# EAGLE design 6502_BASIC (EAGLE 7.1.0)
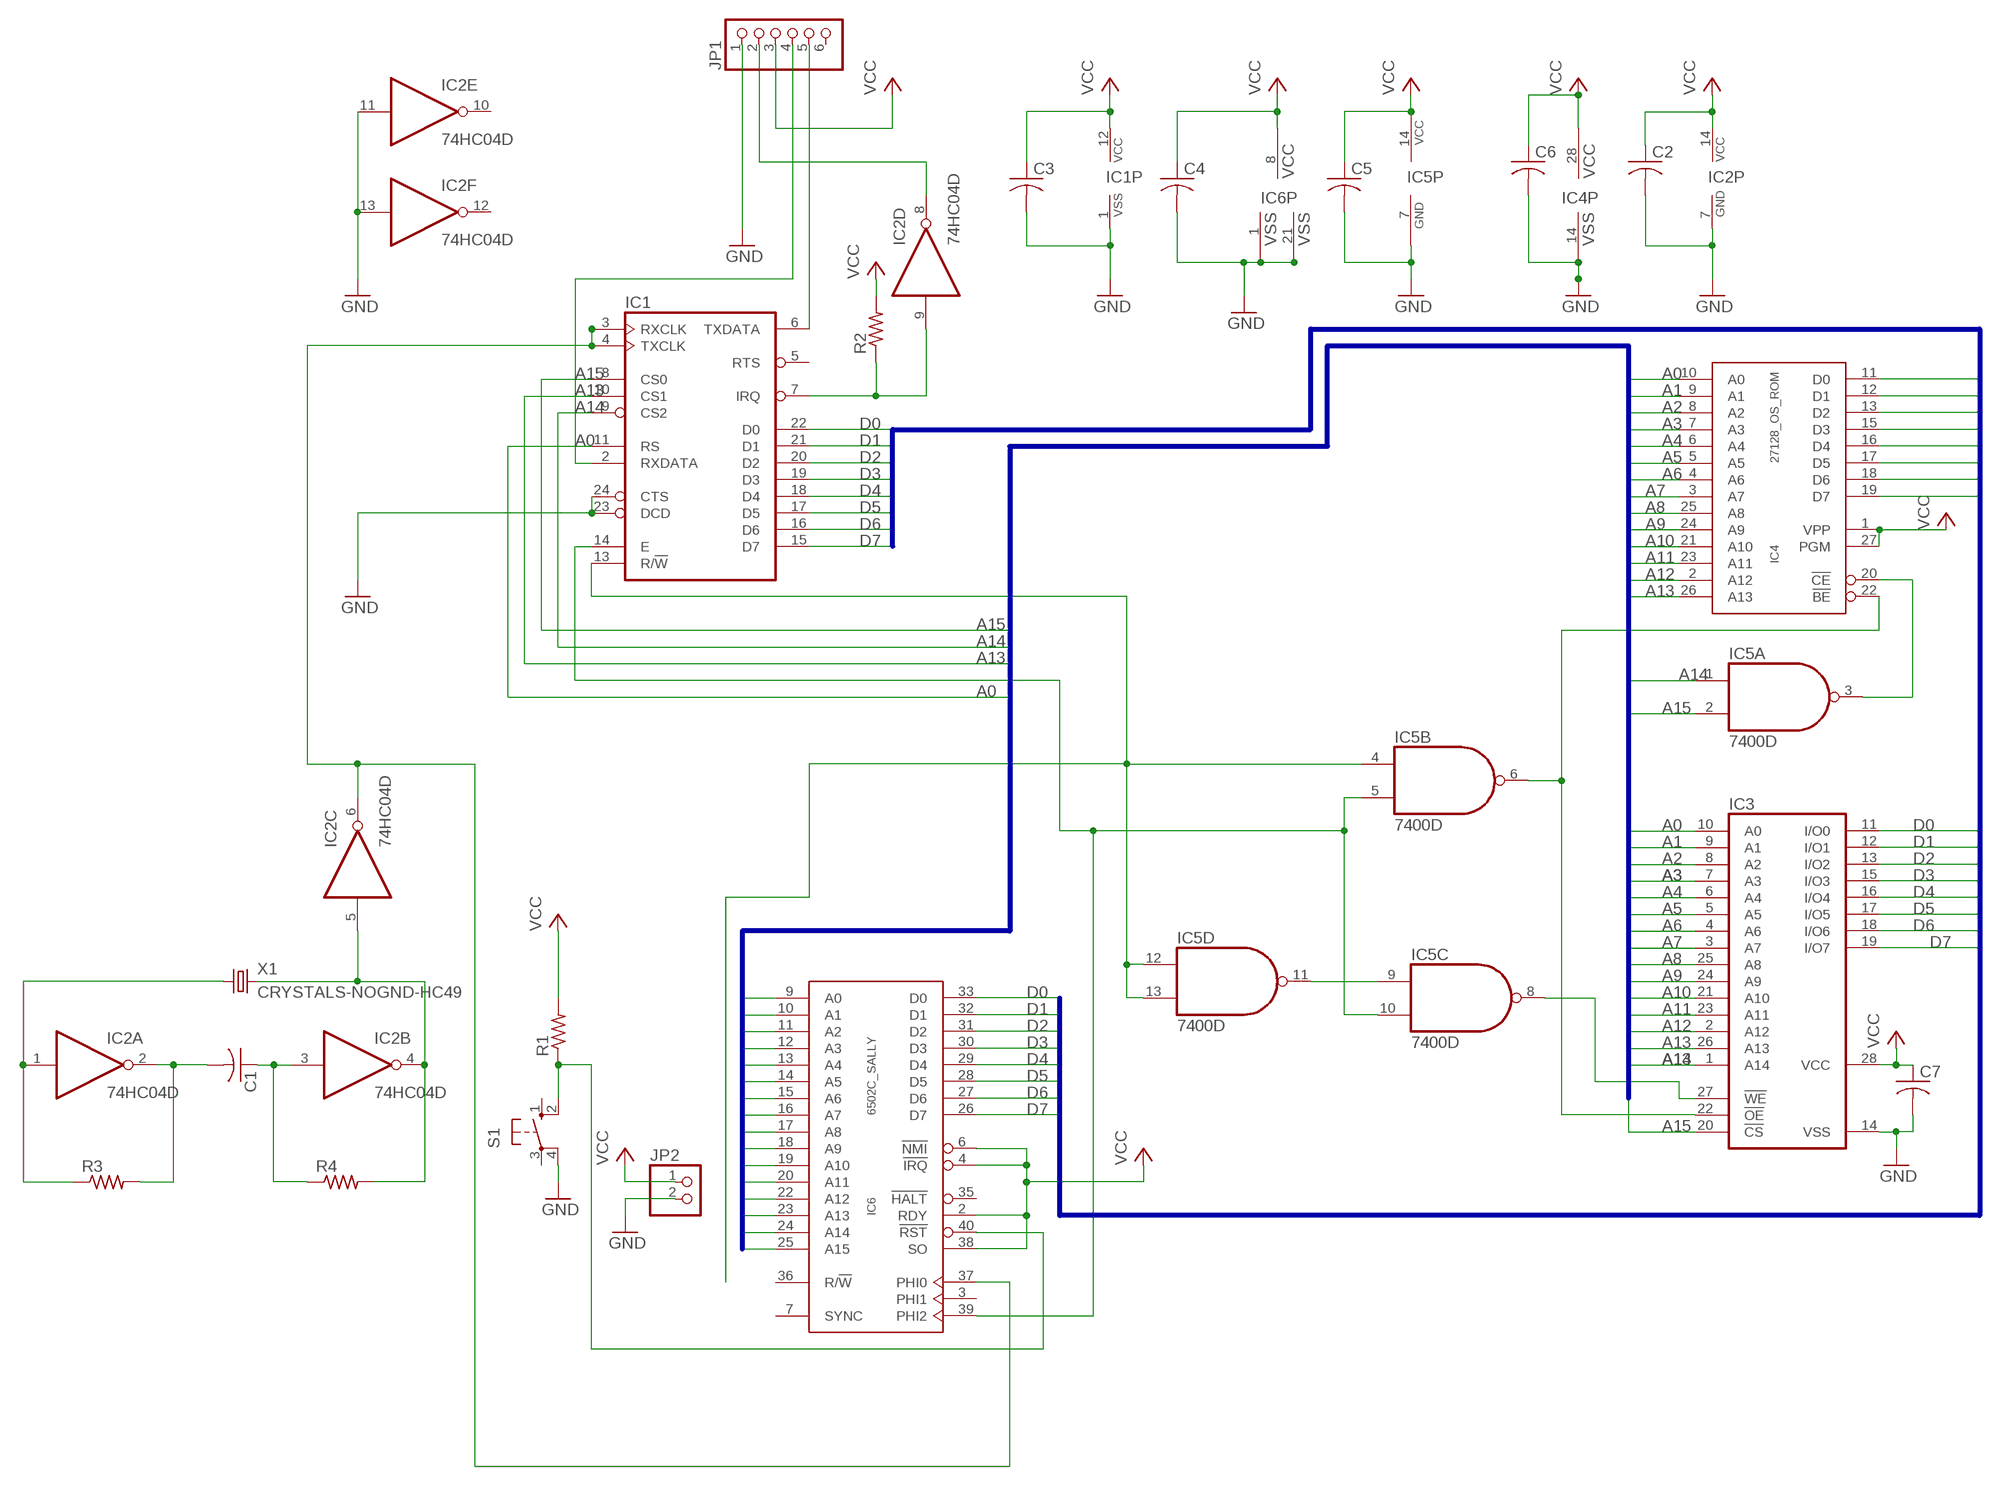
[diagram p0: schematic, sheet 1]

## Parts
C1  C-USC1608  [C1608]
C2  C-USC1608  [C1608]
C3  C-USC1608  [C1608]
C4  C-USC1608  [C1608]
C5  C-USC1608  [C1608]
C6  C-USC1608  [C1608]
C7  C-USC1608  [C1608]
IC1  6850  [DIL24]
IC2  74HC04D  [SO14]
IC3  62256P  [DIL28-6]
IC4  27128_OS_ROM  [DIL28]
IC5  7400D  [SO14]
IC6  6502C_SALLY  [DIL40]
JP1  HEADER-1X6  [1X06_OVAL]
JP2  HEADER-1X2  [1X02_OVAL]
R1  R-US_R0603  [R0603]
R2  R-US_R0603  [R0603]
R3  R-US_R0603  [R0603]
R4  R-US_R0603  [R0603]
S1  10-XX  [B3F-10XX]
X1  CRYSTALS-NOGND-HC49  [HC49]

## Nets
A0: IC1.11(RS) IC3.10(A0) IC4.10(A0) IC6.9(A0)
A1: IC3.9(A1) IC4.9(A1) IC6.10(A1)
A2: IC3.8(A2) IC4.8(A2) IC6.11(A2)
A3: IC3.7(A3) IC4.7(A3) IC6.12(A3)
A4: IC3.6(A4) IC4.6(A4) IC6.13(A4)
A5: IC3.5(A5) IC4.5(A5) IC6.14(A5)
A6: IC3.4(A6) IC4.4(A6) IC6.15(A6)
A7: IC3.3(A7) IC4.3(A7) IC6.16(A7)
A8: IC3.25(A8) IC4.25(A8) IC6.17(A8)
A9: IC3.24(A9) IC4.24(A9) IC6.18(A9)
A10: IC3.21(A10) IC4.21(A10) IC6.19(A10)
A11: IC3.23(A11) IC4.23(A11) IC6.20(A11)
A12: IC3.2(A12) IC4.2(A12) IC6.22(A12)
A13: IC1.10(CS1) IC3.26(A13) IC4.26(A13) IC6.23(A13)
A14: IC1.9(CS2) IC3.1(A14) IC5.1(A:I0) IC6.24(A14)
A15: IC1.8(CS0) IC3.20(!CS) IC5.2(A:I1) IC6.25(A15)
D0: IC1.22(D0) IC3.11(I/O0) IC4.11(D0) IC6.33(D0)
D1: IC1.21(D1) IC3.12(I/O1) IC4.12(D1) IC6.32(D1)
D2: IC1.20(D2) IC3.13(I/O2) IC4.13(D2) IC6.31(D2)
D3: IC1.19(D3) IC3.15(I/O3) IC4.15(D3) IC6.30(D3)
D4: IC1.18(D4) IC3.16(I/O4) IC4.16(D4) IC6.29(D4)
D5: IC1.17(D5) IC3.17(I/O5) IC4.17(D5) IC6.28(D5)
D6: IC1.16(D6) IC3.18(I/O6) IC4.18(D6) IC6.27(D6)
D7: IC1.15(D7) IC3.19(I/O7) IC4.19(D7) IC6.26(D7)
GND: C2.2 C3.2 C4.2 C5.2 C6.2 C7.2 IC1.1(VSS) IC1.23(DCD) IC1.24(CTS) IC2.7(P:GND) IC2.11(E:I) IC2.13(F:I) IC3.14(VSS) IC4.14(VSS) IC5.7(P:GND) IC6.1(VSS) IC6.21(VSS1) JP1.1 JP2.2 S1.4(P1)
N$1: IC3.27(!WE) IC5.8(C:O)
N$2: IC3.22(!OE) IC4.22(!BE) IC5.6(B:O)
N$3: IC1.3(RXCLK) IC1.4(TXCLK) IC2.6(C:O) IC6.37(PHI0)
N$4: IC5.9(C:I0) IC5.11(D:O)
N$5: IC4.20(!CE) IC5.3(A:O)
N$6: IC1.14(E) IC5.5(B:I1) IC5.10(C:I1) IC6.39(PHI2)
N$7: IC1.13(R/!W) IC5.4(B:I0) IC5.12(D:I0) IC5.13(D:I1)
N$8: IC2.4(B:O) IC2.5(C:I) R4.2 X1.2
N$9: IC1.7(IRQ) IC2.9(D:I) R2.1
N$10: IC2.8(D:O) JP1.2
N$11: C1.1 IC2.3(B:I) R4.1
N$12: IC6.40(!RST) R1.1 S1.2(S1)
N$13: C1.2 IC2.2(A:O) R3.2
N$14: IC2.1(A:I) R3.1 X1.1
N$18: IC1.6(TXDATA) JP1.5
N$19: IC1.2(RXDATA) JP1.4
VCC: C2.1 C3.1 C4.1 C5.1 C6.1 C7.1 IC1.12(VCC) IC2.14(P:VCC) IC3.28(VCC) IC4.1(VPP) IC4.27(PGM) IC4.28(VCC) IC5.14(P:VCC) IC6.2(RDY) IC6.4(!IRQ) IC6.6(!NMI) IC6.8(VCC) IC6.38(SO) JP1.3 JP2.1 R1.2 R2.2
Unconnected: IC1.5(RTS) IC2.10(E:O) IC2.12(F:O) IC6.3(PHI1) IC6.7(SYNC) IC6.35(!HALT) IC6.36(R/!W) JP1.6 S1.1(S) S1.3(P)

## Buses
D[0..7]
A[0..15]

## Library data of the parts
C1-C7 = resistor:C-US: CAPACITOR, American symbol
IC1 = micro-motorola:6850: MICROCONTROLLER/MEMORY DEVICE; MF: NTE ELECTRONICS; MPN: NTE6850; OC_FARNELL: 4899775; OC_NEWARK: 31C2457
IC2 = 74xx-eu:74*04: Hex INVERTER
IC3 = memory-hitachi:62256P: MEMORY; OC_FARNELL: unknown; OC_NEWARK: unknown
IC4 = eagle-6.5.0-atari:27128_OS_ROM: 16K x 8 PROM
IC5 = 74xx-us:74*00: Quad 2-input NAND gate
IC6 = eagle-6.5.0-atari:6502C_SALLY: Atari 6502 Custom CPU
JP1 = OLED_mod:HEADER-1X6: PIN HEADER
JP2 = OLED_mod:HEADER-1X2: PIN HEADER
R1-R4 = rcl:R-US_: RESISTOR, American symbol
S1 = switch-omron:10-XX: OMRON SWITCH; MPN: B3F-1000; OC_FARNELL: 176432; OC_NEWARK: 36M3542
X1 = IQD-Frequency-Products:CRYSTALS-NOGND: CRYSTALS CAN NOT GROUNDED

## Board
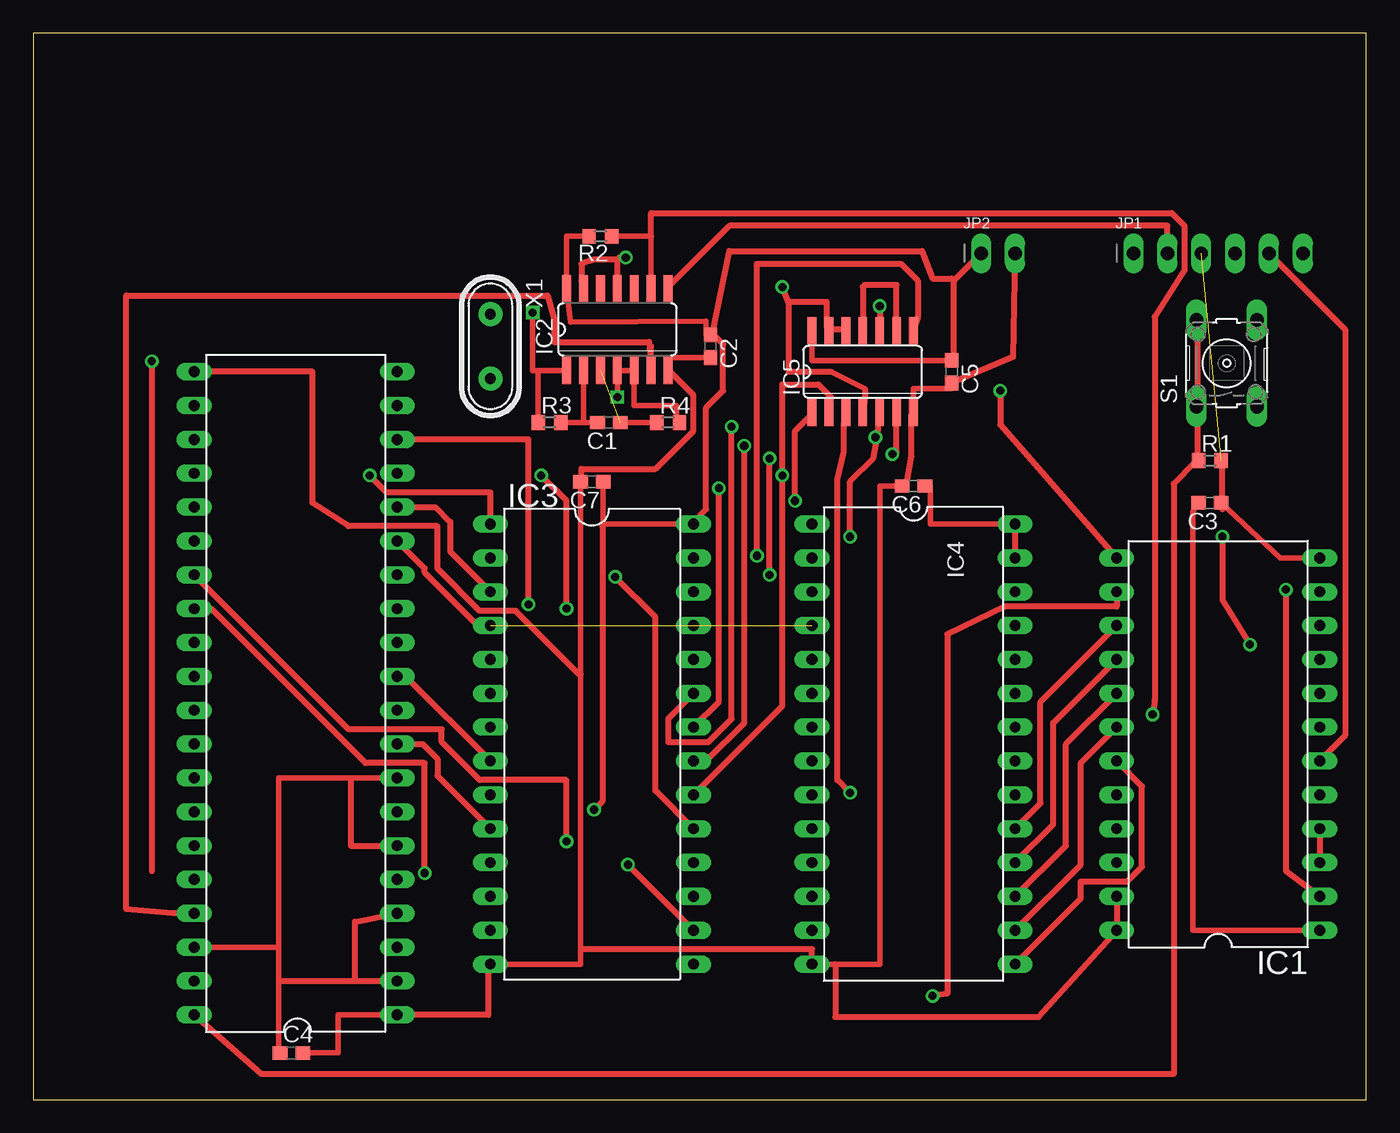
[diagram p1: board, top side]
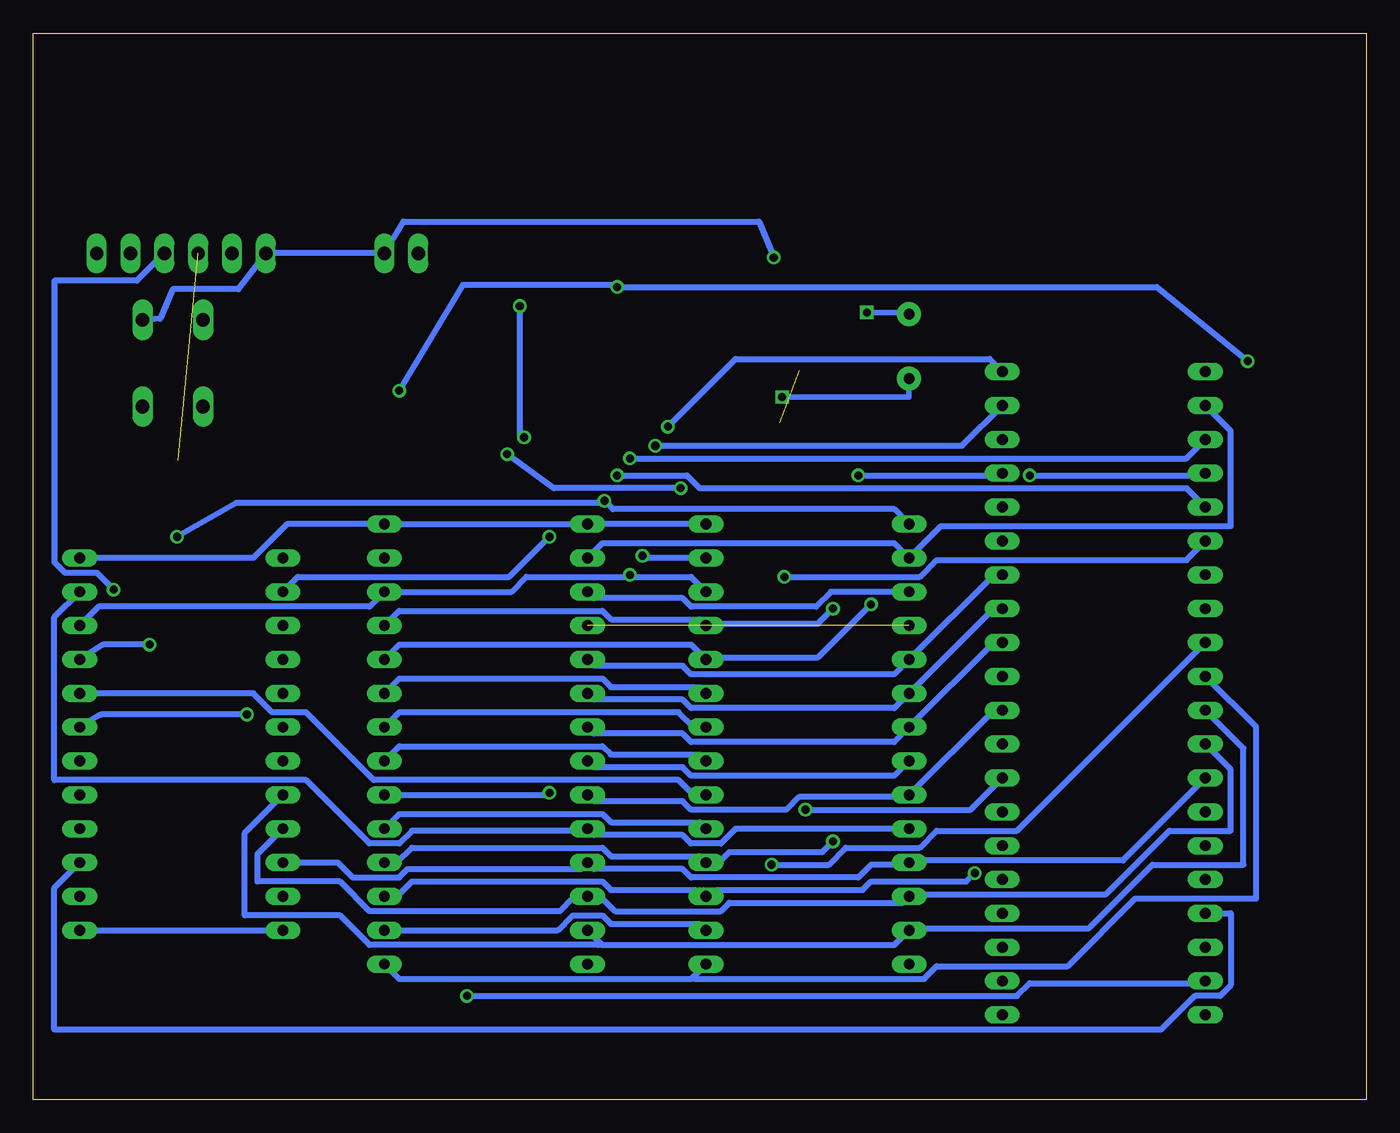
[diagram p2: board, bottom side, seen from below]

Size 100 x 80 mm. Coordinates in mm from the lower left corner, seen from the top.
Outline: 0,0 100,0 100,80 0,80 0,0
Copper layers (1*16): Top 0.035mm / dielectric 1.5mm / Bottom 0.035mm
Design rules "default *": minimum track width 18mil, minimum drill 24mil, track to track 14mil, track to pad 8mil, pad to pad 8mil, via to via 8mil, smd to smd 8mil, copper to edge 40mil, drill to drill 8mil, minimum pad ring 10mil, minimum via ring 8mil, stop-mask expansion 4mil, vias tented up to drill 0mil, thermal gap 10mil
vRestrict: area 57.5,52.4 to 67,56.5

### Footprints (pad centres in the part's own frame; a part is rotated, then mirrored left to right if it is on the bottom)
C1608 = smd 1.1 x 1: 1 -0.85,0; 2 0.85,0
DIL24 = drill 0.813 long: 1 -13.97,-7.62; 2 -11.43,-7.62; 3 -8.89,-7.62; 4 -6.35,-7.62; 5 -3.81,-7.62; 6 -1.27,-7.62; 7 1.27,-7.62; 8 3.81,-7.62; 9 6.35,-7.62; 10 8.89,-7.62; 11 11.43,-7.62; 12 13.97,-7.62; 13 13.97,7.62; 14 11.43,7.62; 15 8.89,7.62; 16 6.35,7.62; 17 3.81,7.62; 18 1.27,7.62; 19 -1.27,7.62; 20 -3.81,7.62; 21 -6.35,7.62; 22 -8.89,7.62; 23 -11.43,7.62; 24 -13.97,7.62
SO14 = smd 0.66 x 2.032: 1 -3.81,-3.073; 2 -2.54,-3.073; 3 -1.27,-3.073; 4 0,-3.073; 5 1.27,-3.073; 6 2.54,-3.073; 7 3.81,-3.073; 8 3.81,3.073; 9 2.54,3.073; 10 1.27,3.073; 11 0,3.073; 12 -1.27,3.073; 13 -2.54,3.073; 14 -3.81,3.073
DIL28-6 = drill 0.813 long: 1 -16.51,-7.62; 2 -13.97,-7.62; 3 -11.43,-7.62; 4 -8.89,-7.62; 5 -6.35,-7.62; 6 -3.81,-7.62; 7 -1.27,-7.62; 8 1.27,-7.62; 9 3.81,-7.62; 10 6.35,-7.62; 11 8.89,-7.62; 12 11.43,-7.62; 13 13.97,-7.62; 14 16.51,-7.62; 15 16.51,7.62; 16 13.97,7.62; 17 11.43,7.62; 18 8.89,7.62; 19 6.35,7.62; 20 3.81,7.62; 21 1.27,7.62; 22 -1.27,7.62; 23 -3.81,7.62; 24 -6.35,7.62; 25 -8.89,7.62; 26 -11.43,7.62; 27 -13.97,7.62; 28 -16.51,7.62
DIL28 = drill 0.813 long: 1 -16.51,-7.62; 2 -13.97,-7.62; 3 -11.43,-7.62; 4 -8.89,-7.62; 5 -6.35,-7.62; 6 -3.81,-7.62; 7 -1.27,-7.62; 8 1.27,-7.62; 9 3.81,-7.62; 10 6.35,-7.62; 11 8.89,-7.62; 12 11.43,-7.62; 13 13.97,-7.62; 14 16.51,-7.62; 15 16.51,7.62; 16 13.97,7.62; 17 11.43,7.62; 18 8.89,7.62; 19 6.35,7.62; 20 3.81,7.62; 21 1.27,7.62; 22 -1.27,7.62; 23 -3.81,7.62; 24 -6.35,7.62; 25 -8.89,7.62; 26 -11.43,7.62; 27 -13.97,7.62; 28 -16.51,7.62
DIL40 = drill 0.813 long: 1 -24.13,-7.62; 2 -21.59,-7.62; 3 -19.05,-7.62; 4 -16.51,-7.62; 5 -13.97,-7.62; 6 -11.43,-7.62; 7 -8.89,-7.62; 8 -6.35,-7.62; 9 -3.81,-7.62; 10 -1.27,-7.62; 11 1.27,-7.62; 12 3.81,-7.62; 13 6.35,-7.62; 14 8.89,-7.62; 15 11.43,-7.62; 16 13.97,-7.62; 17 16.51,-7.62; 18 19.05,-7.62; 19 21.59,-7.62; 20 24.13,-7.62; 21 24.13,7.62; 22 21.59,7.62; 23 19.05,7.62; 24 16.51,7.62; 25 13.97,7.62; 26 11.43,7.62; 27 8.89,7.62; 28 6.35,7.62; 29 3.81,7.62; 30 1.27,7.62; 31 -1.27,7.62; 32 -3.81,7.62; 33 -6.35,7.62; 34 -8.89,7.62; 35 -11.43,7.62; 36 -13.97,7.62; 37 -16.51,7.62; 38 -19.05,7.62; 39 -21.59,7.62; 40 -24.13,7.62
1X06_OVAL = drill 1 long: 1 -6.35,0; 2 -3.81,0; 3 -1.27,0; 4 1.27,0; 5 3.81,0; 6 6.35,0
1X02_OVAL = drill 1 long: 1 -1.27,0; 2 1.27,0
R0603 = smd 1 x 1.1: 1 -0.85,0; 2 0.85,0
B3F-10XX = drill 1.016 long: 1 -3.251,2.261; 2 3.251,2.261; 3 -3.251,-2.261; 4 3.251,-2.261
HC49 = drill 0.813 pad 1.8: 1 -2.413,0; 2 2.413,0

### Placement (x,y rotation side)
C1  43.18,50.8 180 top
C2  50.8,56.52 270 top
C3  88.27,44.77 180 top
C4  19.37,3.49 0 top
C5  68.9,54.61 270 top
C6  66.04,46.04 180 top
C7  41.91,46.35 180 top
IC1  88.9,26.67 90 top
IC2  43.81,57.78 0 top
IC3  41.91,26.67 270 top
IC4  66.04,26.67 270 top
IC5  62.23,54.61 0 top
IC6  19.68,30.48 90 top
JP1  88.9,63.5 0 top
JP2  72.39,63.5 0 top
R1  88.27,47.94 0 top
R2  42.55,64.77 180 top
R3  38.73,50.8 0 top
R4  47.62,50.8 0 top
S1  89.53,55.24 90 top
X1  34.29,56.52 270 top

### Tracks (layer width: path | path; a pad name or v marks a point on that pad's centre or on a via)
A0
  Top 0.457: IC3.10 30.32,24.29 30.32,25.56 29.21,26.67 IC6.9
  Bottom 0.457: IC3.10 47.31,20.32 48.42,19.21 50.64,19.21 51.28,19.84 57.94,19.84 IC4.10 58.58,20.16 71.6,20.16 72.55,19.21 74.77,19.21 79.53,23.97 98.42,23.97 98.42,36.2 IC1.11
A1
  Bottom 0.457: IC6.10 27.94,29.21 IC3.9 34.45,22.7 42.55,22.7 43.5,21.75 50.64,21.75 51.28,22.38 57.94,22.38 IC4.9
A2
  Top 0.457: IC3.8 27.94,31.75 IC6.11
  Bottom 0.457: IC4.8 57.94,24.92 51.28,24.92 50.64,24.29 35.4,24.29 IC3.8
A3
  Bottom 0.457: IC6.12 27.94,34.29 IC3.7 35.4,26.83 50.64,26.83 51.28,27.46 57.94,27.46 IC4.7
A4
  Bottom 0.457: IC6.13 27.94,36.83 IC3.6 35.4,29.37 50.64,29.37 51.28,30 57.94,30 IC4.6
A5
  Bottom 0.457: IC6.14 27.94,39.37 IC3.5 35.4,31.91 50.64,31.91 51.28,32.54 57.94,32.54 IC4.5
A6  (1 unrouted)
  Top 0.457: IC6.15 29.37,39.85 29.37,39.53 33.34,35.56 IC3.4
A7
  Top 0.457: IC3.3 31.27,41.12 31.27,43.34 30.16,44.45 IC6.16
  Bottom 0.457: IC4.3 57.94,37.62 51.28,37.62 50.64,36.99 41.27,36.99 40.16,38.1 IC3.3
A8  (via drill 0.61)
  Top 0.457: v38.1,46.83 40.01,44.93 v40.01,36.83
  Bottom 0.457: IC4.25 72.55,36.67 57.31,36.67 56.67,36.04 50.01,36.04 IC3.25 49.37,35.72 41.12,35.72 v40.01,36.83 | IC6.17 27.46,46.83 v38.1,46.83
A9  (via drill 0.61)
  Top 0.457: IC6.18 37.15,49.53 v37.15,37.15
  Bottom 0.457: IC4.24 72.55,34.13 50.64,34.13 IC3.24 49.37,33.18 41.12,33.18 v37.15,37.15
A10  (via drill 0.61)
  Top 0.457: v53.34,49.05 53.34,28.26 50.48,25.4 IC3.21
  Bottom 0.457: IC3.21 50.01,25.88 56.67,25.88 57.31,26.51 72.55,26.51 IC4.21 | IC6.19 30.32,49.05 v53.34,49.05
A11  (via drill 0.61)
  Top 0.457: v52.39,50.48 52.39,28.57 50.64,26.83 47.62,26.83 47.62,28.57 IC3.23
  Bottom 0.457: IC3.23 50.01,30.96 56.67,30.96 57.31,31.59 72.55,31.59 IC4.23 | IC6.20 28.26,55.56 47.31,55.56 v52.39,50.48
A12
  Bottom 0.457: IC4.2 57.31,41.75 35.4,41.75 IC3.2 31.91,43.02 10.16,43.02 10.16,50.16 IC6.22
A13  (via drill 0.61)
  Top 0.457: v55.24,39.37 v55.24,48.1
  Bottom 0.457: IC3.26 50.64,39.21 55.24,39.21 | 55.24,39.21 63.02,39.21 64.14,38.1 IC4.26 74.77,36.99 95.09,36.99 IC1.10 | IC6.23 13.49,48.1 v55.24,48.1 | v55.24,39.37 55.24,39.21
A14  (via drill 0.61)
  Top 0.457: v57.15,44.93 57.15,50.16 58.42,51.44 IC5.1 | v25.24,46.83 26.51,45.56 34.29,45.56 IC3.1 | v91.28,34.13 89.22,37.47 v89.22,42.23
  Bottom 0.457: IC3.1 35.4,44.29 56.52,44.29 v57.15,44.93 57.31,44.77 84.77,44.77 v89.22,42.23 | IC6.24 12.22,46.83 v25.24,46.83 | IC1.9 94.77,34.13 v91.28,34.13
A15  (via drill 0.61)
  Top 0.457: IC3.20 56.2,29.53 v56.2,46.83 56.2,53.66 58.9,53.66 59.85,52.7 59.69,51.59 IC5.2
  Bottom 0.457: IC6.25 13.49,45.88 50.01,45.88 50.96,46.83 v56.2,46.83 | IC1.8 83.5,30.48 82.07,29.05 79.53,29.05 74.45,23.97 51.59,23.97 50.48,22.86 IC3.20
D0
  Bottom 0.457: IC1.22 77.15,17.78 76.04,16.67 72.55,16.67 71.91,17.3 58.9,17.3 IC4.11 57.94,17.3 51.28,17.3 50.64,16.67 38.1,16.67 37.15,17.62 34.45,17.62 IC3.11 34.13,17.94 18.26,17.94 IC6.33
D1
  Bottom 0.457: IC6.32 10.16,24.77 10.16,20.16 14.76,20.16 19.53,15.4 34.13,15.4 IC3.12 34.77,14.76 47.78,14.76 48.42,14.13 56.36,14.13 57.47,15.24 IC4.12 58.58,15.08 59.53,15.08 60.48,14.13 74.77,14.13 76.99,16.35 83.19,16.35 83.19,18.41 IC1.21
D2
  Bottom 0.457: IC4.13 57.47,11.75 | 57.47,11.75 57.31,11.59 35.4,11.59 IC3.13 34.13,12.86 20.8,12.86 16.03,17.62 9.21,17.62 9.21,26.35 IC6.31 | IC1.20 84.14,20 84.14,13.81 76.99,13.81 74.77,11.59 57.63,11.59 57.47,11.75
D3
  Top 0.457: IC1.19 83.19,23.5 83.19,17.46 82.07,16.35 78.58,16.35 78.58,15.08 IC4.15
  Bottom 0.457: 50.48,9.21 50.64,9.05 72.55,9.05 IC4.15 | 50.48,9.21 IC3.15 | IC6.30 8.26,27.94 8.26,15.08 17.3,15.08 22.38,10 32.23,10 33.18,9.05 50.32,9.05 50.48,9.21
D4  (via drill 0.61)
  Top 0.457: IC3.16 v44.61,17.62 | IC1.18 78.58,25.24 78.58,17.62 IC4.16
  Bottom 0.457: IC3.16 50.01,13.18 56.67,13.18 57.31,13.81 59.53,13.81 60.64,12.7 IC4.16 | IC6.29 26.19,20.16 32.23,20.16 33.5,18.89 39.05,18.89 40.32,17.62 v44.61,17.62
D5  (via drill 0.61)
  Top 0.457: IC6.28 13.34,36.83 24.92,25.24 29.37,25.24 v29.37,16.99 | IC1.17 77.47,26.67 77.47,19.05 IC4.17
  Bottom 0.457: IC4.17 72.71,15.24 71.6,16.35 57.31,16.35 56.67,15.72 50.01,15.72 IC3.17 49.69,15.72 37.78,15.72 37.15,16.35 30,16.35 v29.37,16.99
D6  (via drill 0.61)
  Top 0.457: IC6.27 23.65,27.78 30.64,27.78 30.64,26.83 33.5,23.97 40.01,23.97 v40.01,19.37 | IC1.16 76.52,28.26 76.52,20.64 IC4.18
  Bottom 0.457: IC4.18 72.71,17.78 71.6,18.89 57.31,18.89 56.67,18.26 50.01,18.26 IC3.18 49.37,17.94 48.42,17.94 47.78,18.57 40.8,18.57 v40.01,19.37
D7  (via drill 0.61)
  Top 0.457: v43.66,39.21 46.67,36.2 46.67,23.18 IC3.19 | IC1.15 75.56,29.84 75.56,22.23 IC4.19
  Bottom 0.457: IC3.19 50.01,20.8 56.67,20.8 57.31,21.43 72.55,21.43 IC4.19 | IC6.26 13.49,40.48 32.23,40.48 33.5,39.21 v43.66,39.21
GND  (via drill 0.61)
  Top 0.406: C4.2 22.86,3.49 22.86,6.35 IC6.1 | IC3.14 41.06,10.16 41.06,11.27 41.06,31.91 C7.2 | C6.2 63.5,46.04 63.5,10.16 60.17,10.16 IC4.14 | C3.2 87,44.13 87,12.7 IC1.1 | IC5.7 66.04,53.34 68.9,53.34 C5.2 | C2.2 47.62,55.66 IC2.7
  Top 0.457: IC6.21 20.95,54.61 20.95,44.77 23.65,43.02 30.32,43.02 30.32,39.85 33.5,36.67 36.2,36.67 40.96,31.91 41.06,31.91 | IC2.7 47.78,54.61 49.53,52.86 49.53,50.16 46.67,47.31 41.12,47.31 41.12,46.51 C7.2 | IC6.1 34.13,6.35 34.13,10.16 IC3.14 | IC1.23 IC1.24 75.41,6.19 60.17,6.19 60.17,10.16 | IC5.7 65.88,51.44 65.88,48.26 65.56,46.51 65.25,46.2 C6.2 | 43.81,63.02 42.07,63.02 41.12,62.71 41.12,61.44 41.27,60.96 IC2.13 | IC2.11 43.81,63.02 | v44.45,63.18 43.97,63.18 43.81,63.02 | JP2.2 73.5,55.72 C5.2 | 41.06,11.27 58.42,11.27 IC4.14
  Bottom 0.457: IC1.1 IC1.24 | v44.45,63.18 45.56,65.88 72.23,65.88 JP2.2 JP1.1 84.61,60.8 89.53,60.8 90.49,58.58 S1.4
N$1  (via drill 0.61)
  Top 0.457: v54.29,40.8 54.29,62.71 65.09,62.71 66.36,61.44 66.36,58.74 66.04,57.78 IC5.8
  Bottom 0.457: v54.29,40.8 54.13,40.64 IC3.27
N$2  (via drill 0.61)
  Top 0.457: IC5.6 64.77,48.58 v64.45,48.42 | v51.44,45.88 51.44,29.84 IC3.22
  Bottom 0.457: v64.45,48.42 60.96,45.88 v51.44,45.88 | IC4.22 72.55,29.05 51.59,29.05 50.48,27.94 IC3.22
N$3
  Top 0.457: IC1.4 IC1.3 | 46.35,55.24 46.2,56.83 39.05,56.83 39.05,58.58 38.58,60.33 6.99,60.33 6.99,14.29 10.48,13.97 IC6.37 | 46.35,55.24 46.35,56.52 | 46.35,55.24 IC2.6
  Bottom 0.457: IC1.3 98.42,15.88 98.42,5.24 15.4,5.24 12.86,7.78 10.95,7.78 10.16,8.57 10.16,13.97 IC6.37
N$4
  Top 0.457: IC5.11 62.23,60.96 62.39,61.12 64.77,61.12 IC5.9
N$5  (via drill 0.61)
  Top 0.457: v61.28,23.02 60.33,23.97 60.33,46.51 60.8,48.58 60.8,50.64 60.96,51.44 IC5.3
  Bottom 0.457: v61.28,23.02 61.44,22.86 IC4.20
N$6  (via drill 0.61)
  Top 0.457: 63.34,49.69 63.5,51.44 IC5.5 | 63.34,49.69 63.02,48.1 61.28,46.35 v61.28,42.23 | v63.5,59.53 IC5.10 | v63.18,49.69 63.34,49.69 | v67.47,7.78 68.58,7.94 68.58,34.92 72.87,36.99 81.28,36.99 IC1.14
  Bottom 0.457: v61.28,42.23 64.29,39.21 80.17,39.21 IC1.14 | v63.5,59.53 63.5,49.69 v63.18,49.69 | IC6.39 12.22,8.73 25.24,8.73 26.19,7.78 v67.47,7.78
N$7  (via drill 0.61)
  Top 0.457: IC5.12 60.96,57.78 59.69,57.78 IC5.13 59.53,57.94 59.53,59.85 56.67,59.85 | 56.67,59.85 56.67,54.61 59.85,54.61 62.39,53.34 62.39,52.7 62.23,51.59 IC5.4 | v8.89,55.4 8.89,17.14 | 56.67,59.85 v56.2,60.96 | IC1.13 72.55,50.64 v72.55,53.18
  Bottom 0.457: v8.89,55.4 15.72,60.96 v56.2,60.96 56.36,61.12 67.79,61.12 v72.55,53.18
N$8  (via drill 0.6)
  Top 0.406: R4.2 48.26,50.8 48.26,52.07 45.09,52.07 IC2.5 IC2.4 v43.81,52.7
  Bottom 0.406: v43.81,52.7 34.29,52.7 X1.2
N$9  (via drill 0.61)
  Top 0.406: R2.1 46.35,64.77 IC2.9
  Top 0.457: v83.98,28.89 84.14,30 84.14,58.74 86.36,62.23 86.36,65.56 85.41,66.52 46.35,66.52 46.35,64.77
  Bottom 0.457: IC1.7 94.93,28.89 v83.98,28.89
N$10
  Top 0.457: JP1.2 85.09,65.56 52.23,65.56 47.62,60.96 IC2.8
N$11  (1 unrouted)
  Top 0.406: C1.1 R4.1
N$12
  Top 0.457: S1.2 87.31,57.15 87.31,47.94 R1.1 87.15,47.78 85.57,46.2 85.57,1.91 17.14,1.91 IC6.40
N$13
  Top 0.406: R3.2 41.27,50.8 | 41.27,50.8 C1.2 | IC2.2 41.27,50.8
N$14  (via drill 0.6)
  Top 0.406: R3.1 37.88,54.71 IC2.1 37.47,54.71 v37.47,59.05
  Bottom 0.406: v37.47,59.05 34.29,59.05 X1.1
N$18
  Top 0.457: IC1.6 98.42,27.3 98.42,57.78 JP1.5
N$19  (via drill 0.61)
  Top 0.457: IC1.2 93.98,17.14 v93.98,38.26
  Bottom 0.457: v93.98,38.26 95.25,39.53 97.63,39.53 98.42,40.32 98.42,61.44 92.23,61.44 JP1.4
VCC  (via drill 0.61)  (1 unrouted)
  Top 0.406: C4.1 18.41,3.49 18.41,8.89 18.41,11.43 | 18.41,11.43 18.41,19.05 18.41,24.13 23.81,24.13 IC6.8 | IC6.38 18.41,11.43 | IC3.28 42.76,43.18 C7.1 | C6.1 67.31,46.04 67.31,43.18 IC4.28 | IC1.12 93.56,40.64 C3.1 | C5.1 58.42,55.46 IC5.14 | C2.1 50.48,57.37 50.48,58.42 40.32,58.32 IC2.14 40.01,64.77 R2.2
  Top 0.457: 69.06,61.44 JP2.1 | 69.06,61.44 69.06,55.56 C5.1 | 69.06,61.44 68.9,61.59 67.47,61.59 66.67,63.66 52.23,63.66 50.96,57.47 C2.1 51.12,57.31 51.75,56.67 51.75,53.18 50.48,51.91 50.48,44.29 49.53,43.34 IC3.28 | 18.41,8.89 24.13,8.89 | 24.13,8.89 IC6.2 | IC6.4 24.13,13.34 24.13,8.89 | IC6.6 23.81,19.05 23.81,24.13 | R1.2 89.22,47.94 89.22,44.29 C3.1 | IC4.28 IC4.27 | v42.07,21.75 42.7,22.38 42.7,43.02 42.76,43.18
  Bottom 0.457: IC3.28 IC4.1 IC4.28 80.96,43.18 83.5,40.64 IC1.12 | IC6.8 29.69,21.75 v42.07,21.75